# Altium schematic sheet 8pos_switch.SchDoc
size A4; SheetNumber: 12; SheetTotal: 12
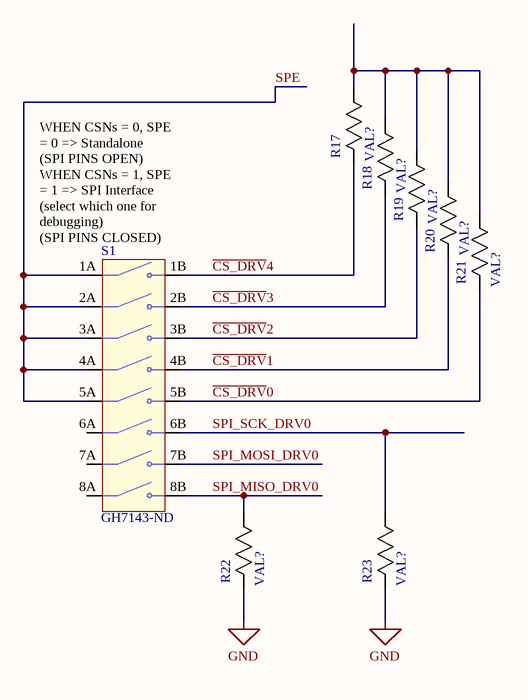
[diagram p0: 8pos_switch.SchDoc]

## Parts
R17  VAL?  [0805]
R18  VAL?  [0805]
R19  VAL?  [0805]
R20  VAL?  [0805]
R21  VAL?  [0805]
R22  VAL?  [0805]
R23  VAL?  [0805]
S1  Supplier Part Number 1: GH7143-ND  [SW 8POS PIANO]  (hidden comment: SW 8POS PIANO DIP)

## Nets
GND: R22.2(R2) R23.2(R2)
~{CS_DRV}0: R21.2(R2) S1.5B(NO5)
~{CS_DRV}1: R20.2(R2) S1.4B(NO4)
~{CS_DRV}2: R19.2(R2) S1.3B(NO3)
~{CS_DRV}3: R18.2(R2) S1.2B(NO2)
~{CS_DRV}4: R17.2(R2) S1.1B(NO1)
SPE: S1.1A(COM1) S1.2A(COM2) S1.3A(COM3) S1.4A(COM4) S1.5A(COM5)
SPI_MISO_DRV0: R22.1(R1) S1.8B(NO8)
SPI_MOSI_DRV0: S1.7B(NO7)
SPI_SCK_DRV0: R23.1(R1) S1.6B(NO6)
NetR17_1: R17.1(R1) R18.1(R1) R19.1(R1) R20.1(R1) R21.1(R1)

Not connected (* = marked no-connect by the designer): S1 6A(COM6) 7A(COM7) 8A(COM8)

## Notes on the sheet
- (near S1) WHEN CSNs = 0, SPE = 0 => Standalone
  (SPI PINS OPEN)
  WHEN CSNs = 1, SPE = 1 => SPI Interface (select which one for debugging)
  (SPI PINS CLOSED)

## Library data of the parts
R17-R23 = RES 10k 1/8W - 5%: Default Resistor Symbol; Value: 1; Power (Watts): 0.125W; Tolerance: 5%; Package: 0805; Part Number: RES 10k 1/8W - 5%
S1 = SW 8POS PIANO DIP: GRAYHILL         76PSB08ST             DIP / SIP Switch, 76 Series, SPST, Through Hole, 8 Circuits, DIP Sealed, 30 VDC; Manufacturer Part Number: 76PSB08ST / TL3305BF260QG; Supplier 1: Digi-Key; Part Number: SW 8POS PIANO DIP; Supplier URL 1: https://www.digikey.ca/en/products/detail/grayhill-inc/76PSB08ST/726200?s=N4IgTCBcDaIOIAkDsBGALAZgLQDkAiIAugL5A